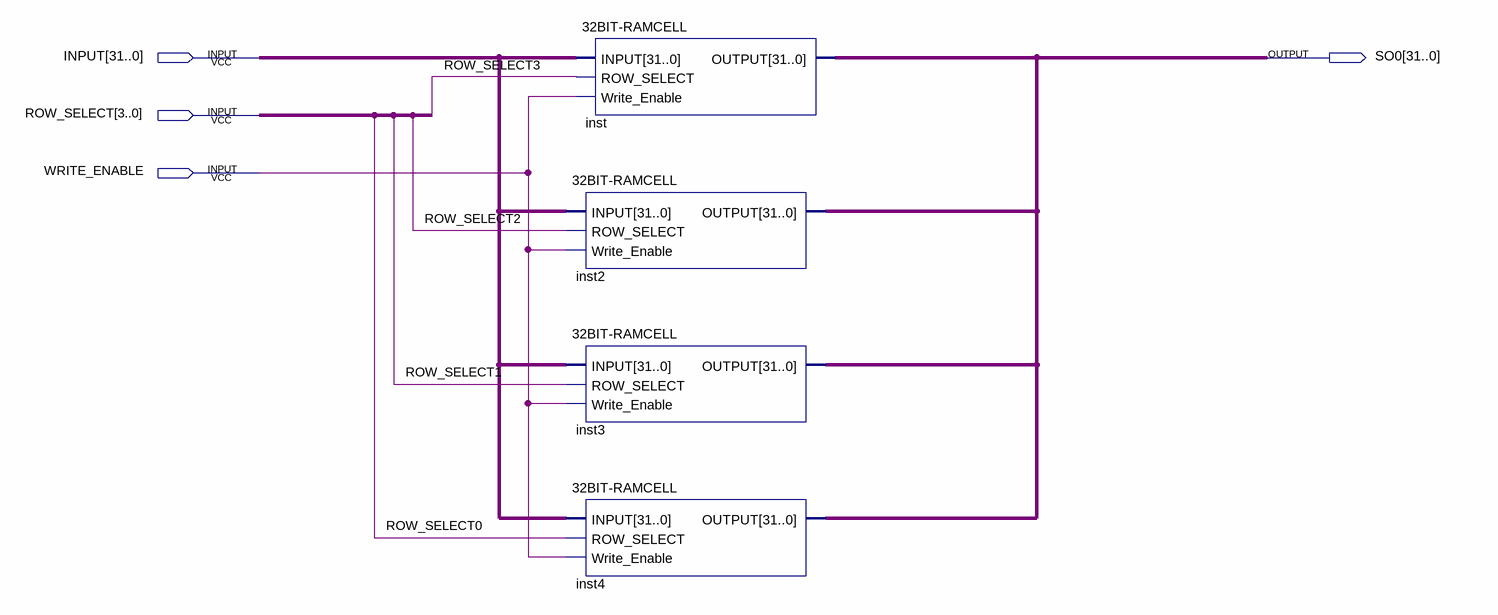
[diagram p0: schematic sheet]
// Quartus schematic Ram32x4.bdf as structural Verilog: 4 symbols, 4 pins
module Ram32x4 (
  input  [31:0] INPUT,
  input  [3:0] ROW_SELECT,
  input  WRITE_ENABLE,
  output [31:0] SO0
);

  \32BIT-RAMCELL  inst (.INPUT(INPUT), .ROW_SELECT(ROW_SELECT[3]), .Write_Enable(WRITE_ENABLE), .OUTPUT(SO0));
  \32BIT-RAMCELL  inst2 (.INPUT(INPUT), .ROW_SELECT(ROW_SELECT[2]), .Write_Enable(WRITE_ENABLE), .OUTPUT(SO0));
  \32BIT-RAMCELL  inst3 (.INPUT(INPUT), .ROW_SELECT(ROW_SELECT[1]), .Write_Enable(WRITE_ENABLE), .OUTPUT(SO0));
  \32BIT-RAMCELL  inst4 (.INPUT(INPUT), .ROW_SELECT(ROW_SELECT[0]), .Write_Enable(WRITE_ENABLE), .OUTPUT(SO0));
endmodule
